# EAGLE design LSR_GPS_Tracker_Base_Station (EAGLE 9.7.0)

## Sheet 1 of 2
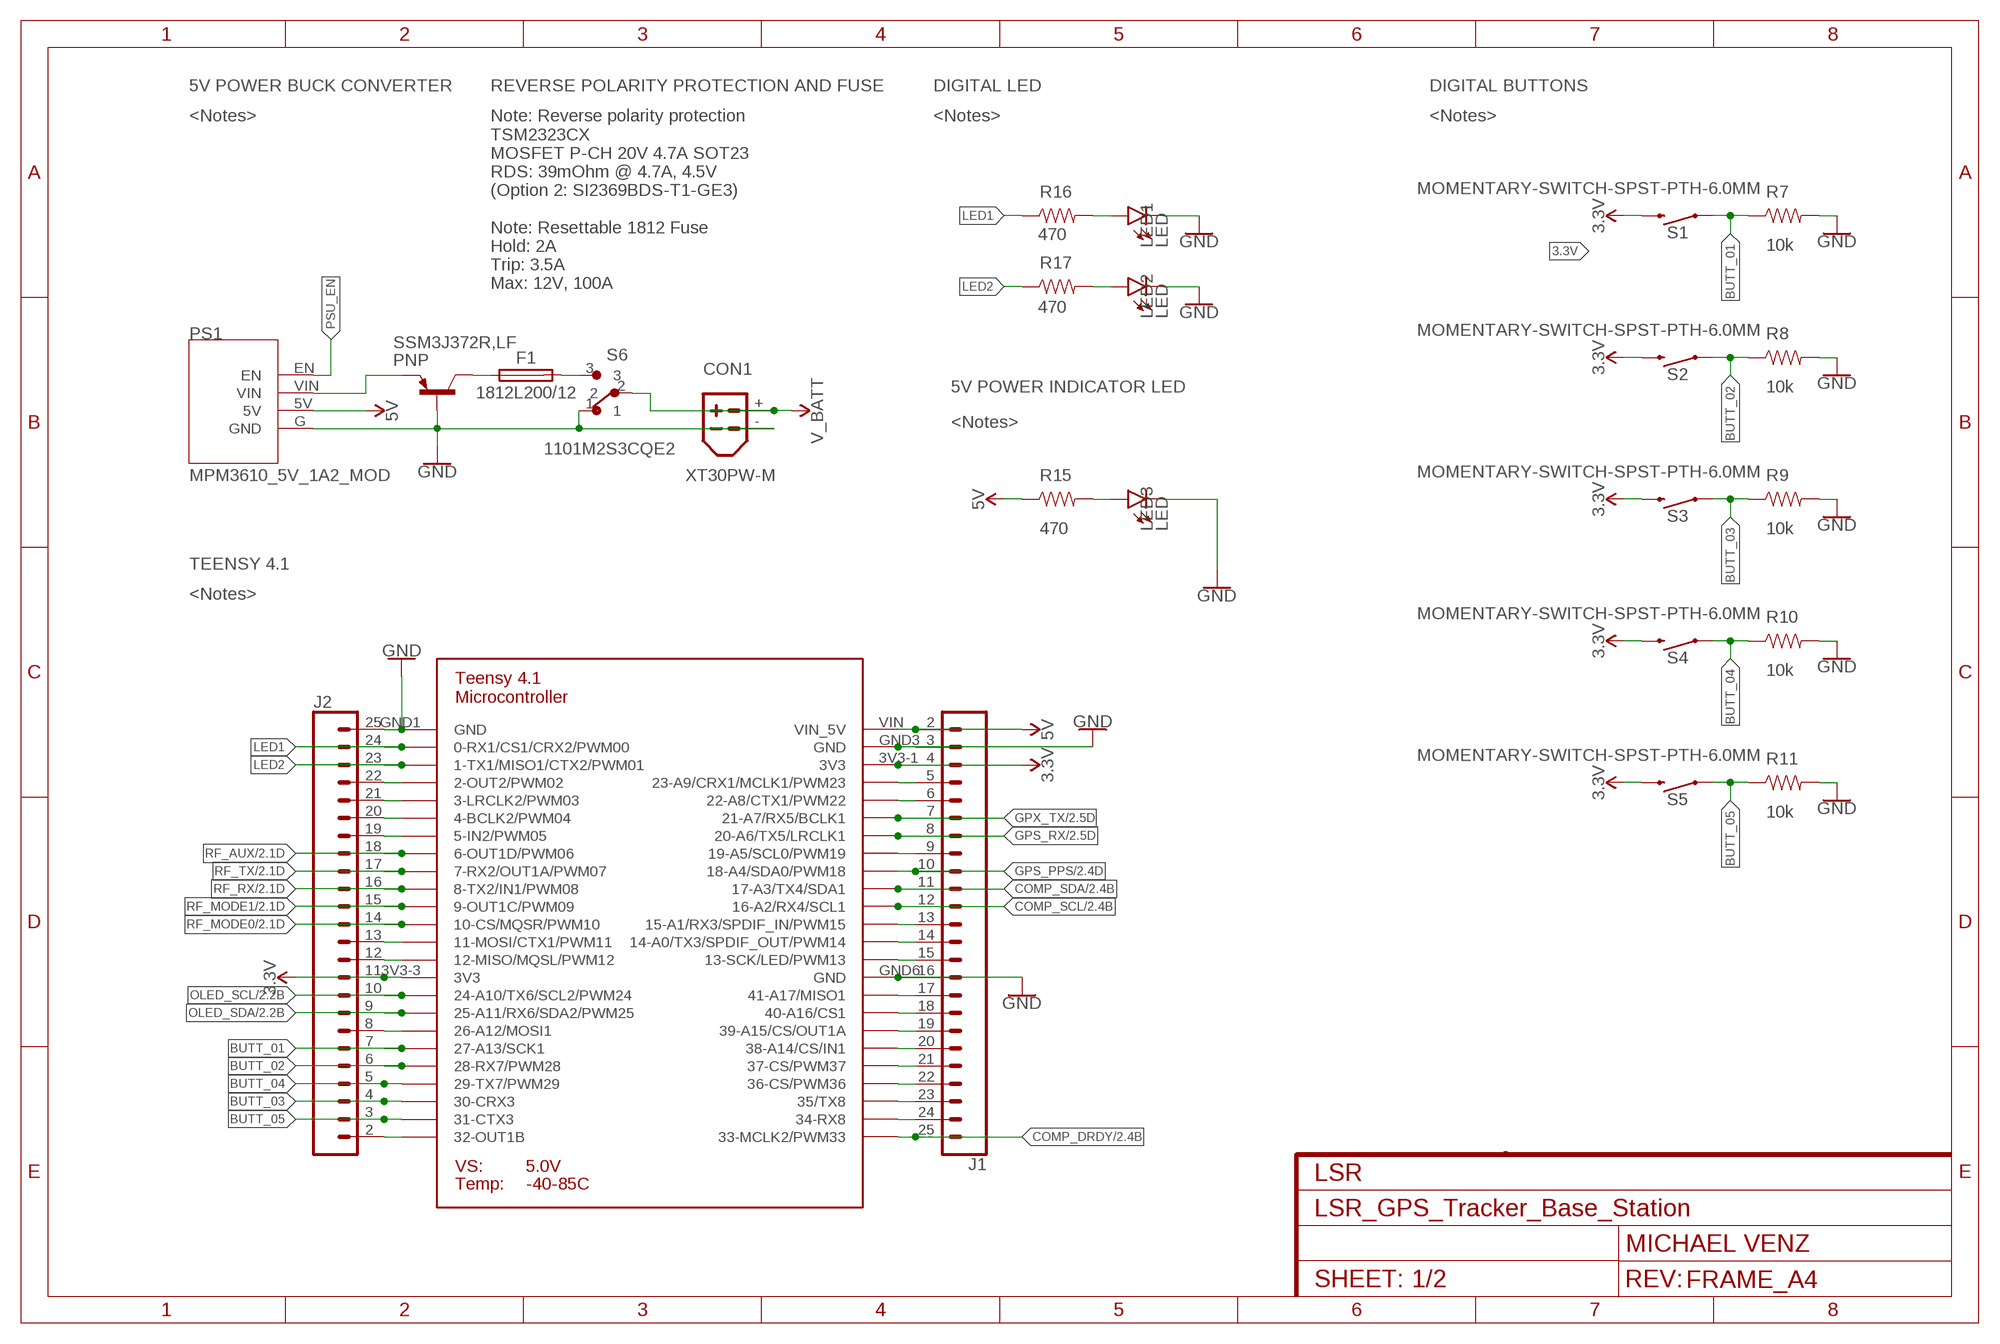
[diagram p0: schematic, sheet 1]

### Parts
CON1  XT30PW-M  [XT30PW-PLUG]
F1  1812L200/12  [FUSC4532X125]
J1  CONN_24  [1X24]
J2  CONN_24  [1X24]
LED1  LED  [0805_LED]
LED2  LED  [0805_LED]
LED3  LED  [0805_LED]
PS1  MPM3610_5V_1A2_MOD  [MPM3610_5V_1A2_FP]
R7  10k  0805_RESISTOR  [0805_RESISTOR_FP]
R8  10k  0805_RESISTOR  [0805_RESISTOR_FP]
R9  10k  0805_RESISTOR  [0805_RESISTOR_FP]
R10  10k  0805_RESISTOR  [0805_RESISTOR_FP]
R11  10k  0805_RESISTOR  [0805_RESISTOR_FP]
R15  470  0805_RESISTOR  [0805_RESISTOR_FP]
R16  470  0805_RESISTOR  [0805_RESISTOR_FP]
R17  470  0805_RESISTOR  [0805_RESISTOR_FP]
S1  MOMENTARY-SWITCH-SPST-PTH-6.0MM  [TACTILE_SWITCH_PTH_6.0MM]
S2  MOMENTARY-SWITCH-SPST-PTH-6.0MM  [TACTILE_SWITCH_PTH_6.0MM]
S3  MOMENTARY-SWITCH-SPST-PTH-6.0MM  [TACTILE_SWITCH_PTH_6.0MM]
S4  MOMENTARY-SWITCH-SPST-PTH-6.0MM  [TACTILE_SWITCH_PTH_6.0MM]
S5  MOMENTARY-SWITCH-SPST-PTH-6.0MM  [TACTILE_SWITCH_PTH_6.0MM]
S6  1101M2S3CQE2  [SW_1101M2S3CQE2]
SSM3J372R,LF  PNP  PNP_SOT23  [SOT95P237X112-3N]
U$3  TEENSY_4_1  [TEENSY_4_1_FP]

### Nets
3.3V: J1.4 J2.11 S1.3 S2.3 S3.3 S4.3 S5.3 U$3.3V3-1(3V3) U$3.3V3-3(3V3) ; also sheet 2
5V: J1.2 PS1.5V R15.1 U$3.VIN(VIN_5V) ; also sheet 2
BUTT_01: J2.7 R7.1 S1.1 U$3.27-A13/SCK1
BUTT_02: J2.6 R8.1 S2.1 U$3.28-RX7/PWM28
BUTT_03: J2.4 R9.1 S3.1 U$3.30-CRX3
BUTT_04: J2.5 R10.1 S4.1 U$3.29-TX7/PWM29
BUTT_05: J2.3 R11.1 S5.1 U$3.31-CTX3
COMP_DRDY: J1.25 U$3.33-MCLK2/PWM33 ; also sheet 2
COMP_SCL: J1.12 U$3.16-A2/RX4/SCL1 ; also sheet 2
COMP_SDA: J1.11 U$3.17-A3/TX4/SDA1 ; also sheet 2
GND: CON1.- J1.3 J1.16 J2.25 LED1.C LED2.C LED3.C PS1.G(GND) R7.2 R8.2 R9.2 R10.2 R11.2 S6.1 SSM3J372R,LF.1(B) U$3.GND1(GND) U$3.GND3(GND) U$3.GND6(GND) ; also sheet 2
GPS_PPS: J1.10 U$3.18-A4/SDA0/PWM18 ; also sheet 2
GPS_RX: J1.8 U$3.20-A6/TX5/LRCLK1 ; also sheet 2
GPX_TX: J1.7 U$3.21-A7/RX5/BCLK1 ; also sheet 2
LED1: J2.24 R16.1 U$3.0-RX1/CS1/CRX2/PWM00
LED2: J2.23 R17.1 U$3.1-TX1/MISO1/CTX2/PWM01
N$1: J1.5 U$3.23-A9/CRX1/MCLK1/PWM23
N$2: J1.6 U$3.22-A8/CTX1/PWM22
N$4: J1.13 U$3.15-A1/RX3/SPDIF_IN/PWM15
N$6: J2.2 U$3.32-OUT1B
N$7: J1.14 U$3.14-A0/TX3/SPDIF_OUT/PWM14
N$8: J1.15 U$3.13-SCK/LED/PWM13
N$9: J1.17 U$3.41-A17/MISO1
N$10: J1.18 U$3.40-A16/CS1
N$11: J1.19 U$3.39-A15/CS/OUT1A
N$12: J1.20 U$3.38-A14/CS/IN1
N$13: J1.21 U$3.37-CS/PWM37
N$14: J1.22 U$3.36-CS/PWM36
N$15: J1.23 U$3.35-TX8(35/TX8)
N$16: J1.24 U$3.34-RX8
N$19: J1.9 U$3.19-A5/SCL0/PWM19
N$20: J2.21 U$3.3-LRCLK2/PWM03
N$21: J2.20 U$3.4-BCLK2/PWM04
N$22: J2.19 U$3.5-IN2/PWM05
N$23: J2.13 U$3.11-MOSI/CTX1/PWM11
N$24: J2.12 U$3.12-MISO/MQSL/PWM12
N$26: J2.8 U$3.26-A12/MOSI1
N$28: J2.22 U$3.2-OUT2/PWM02
N$32: LED3.A R15.2
N$33: LED1.A R16.2
N$42: F1.2 S6.3
N$43: F1.1 SSM3J372R,LF.3(C)
N$44: PS1.VIN SSM3J372R,LF.2(E)
N$53: LED2.A R17.2
OLED_SCL: J2.10 U$3.24-A10/TX6/SCL2/PWM24 ; also sheet 2
OLED_SDA: J2.9 U$3.25-A11/RX6/SDA2/PWM25 ; also sheet 2
PSU_EN: PS1.EN
RF_AUX: J2.18 U$3.6-OUT1D/PWM06 ; also sheet 2
RF_MODE0: J2.14 U$3.10-CS\MQSR/PWM10(10-CS/MQSR/PWM10) ; also sheet 2
RF_MODE1: J2.15 U$3.9-OUT1C/PWM09 ; also sheet 2
RF_RX: J2.16 U$3.8-TX2/IN1/PWM08 ; also sheet 2
RF_TX: J2.17 U$3.7-RX2/OUT1A/PWM07 ; also sheet 2
V_BATT: CON1.+ S6.2

### Notes on the sheet
- 5V POWER BUCK CONVERTER | REVERSE POLARITY PROTECTION AND FUSE | DIGITAL LED | DIGITAL BUTTONS
- <Notes>
- Note: Reverse polarity protection
  TSM2323CX 
  MOSFET P-CH 20V 4.7A SOT23
  RDS: 39mOhm @ 4.7A, 4.5V
  (Option 2: SI2369BDS-T1-GE3)
  
  Note: Resettable 1812 Fuse 
  Hold: 2A
  Trip: 3.5A
  Max: 12V, 100A
- <Notes> | <Notes>
- 5V POWER INDICATOR LED
- <Notes>
- TEENSY 4.1
- <Notes>

## Sheet 2 of 2
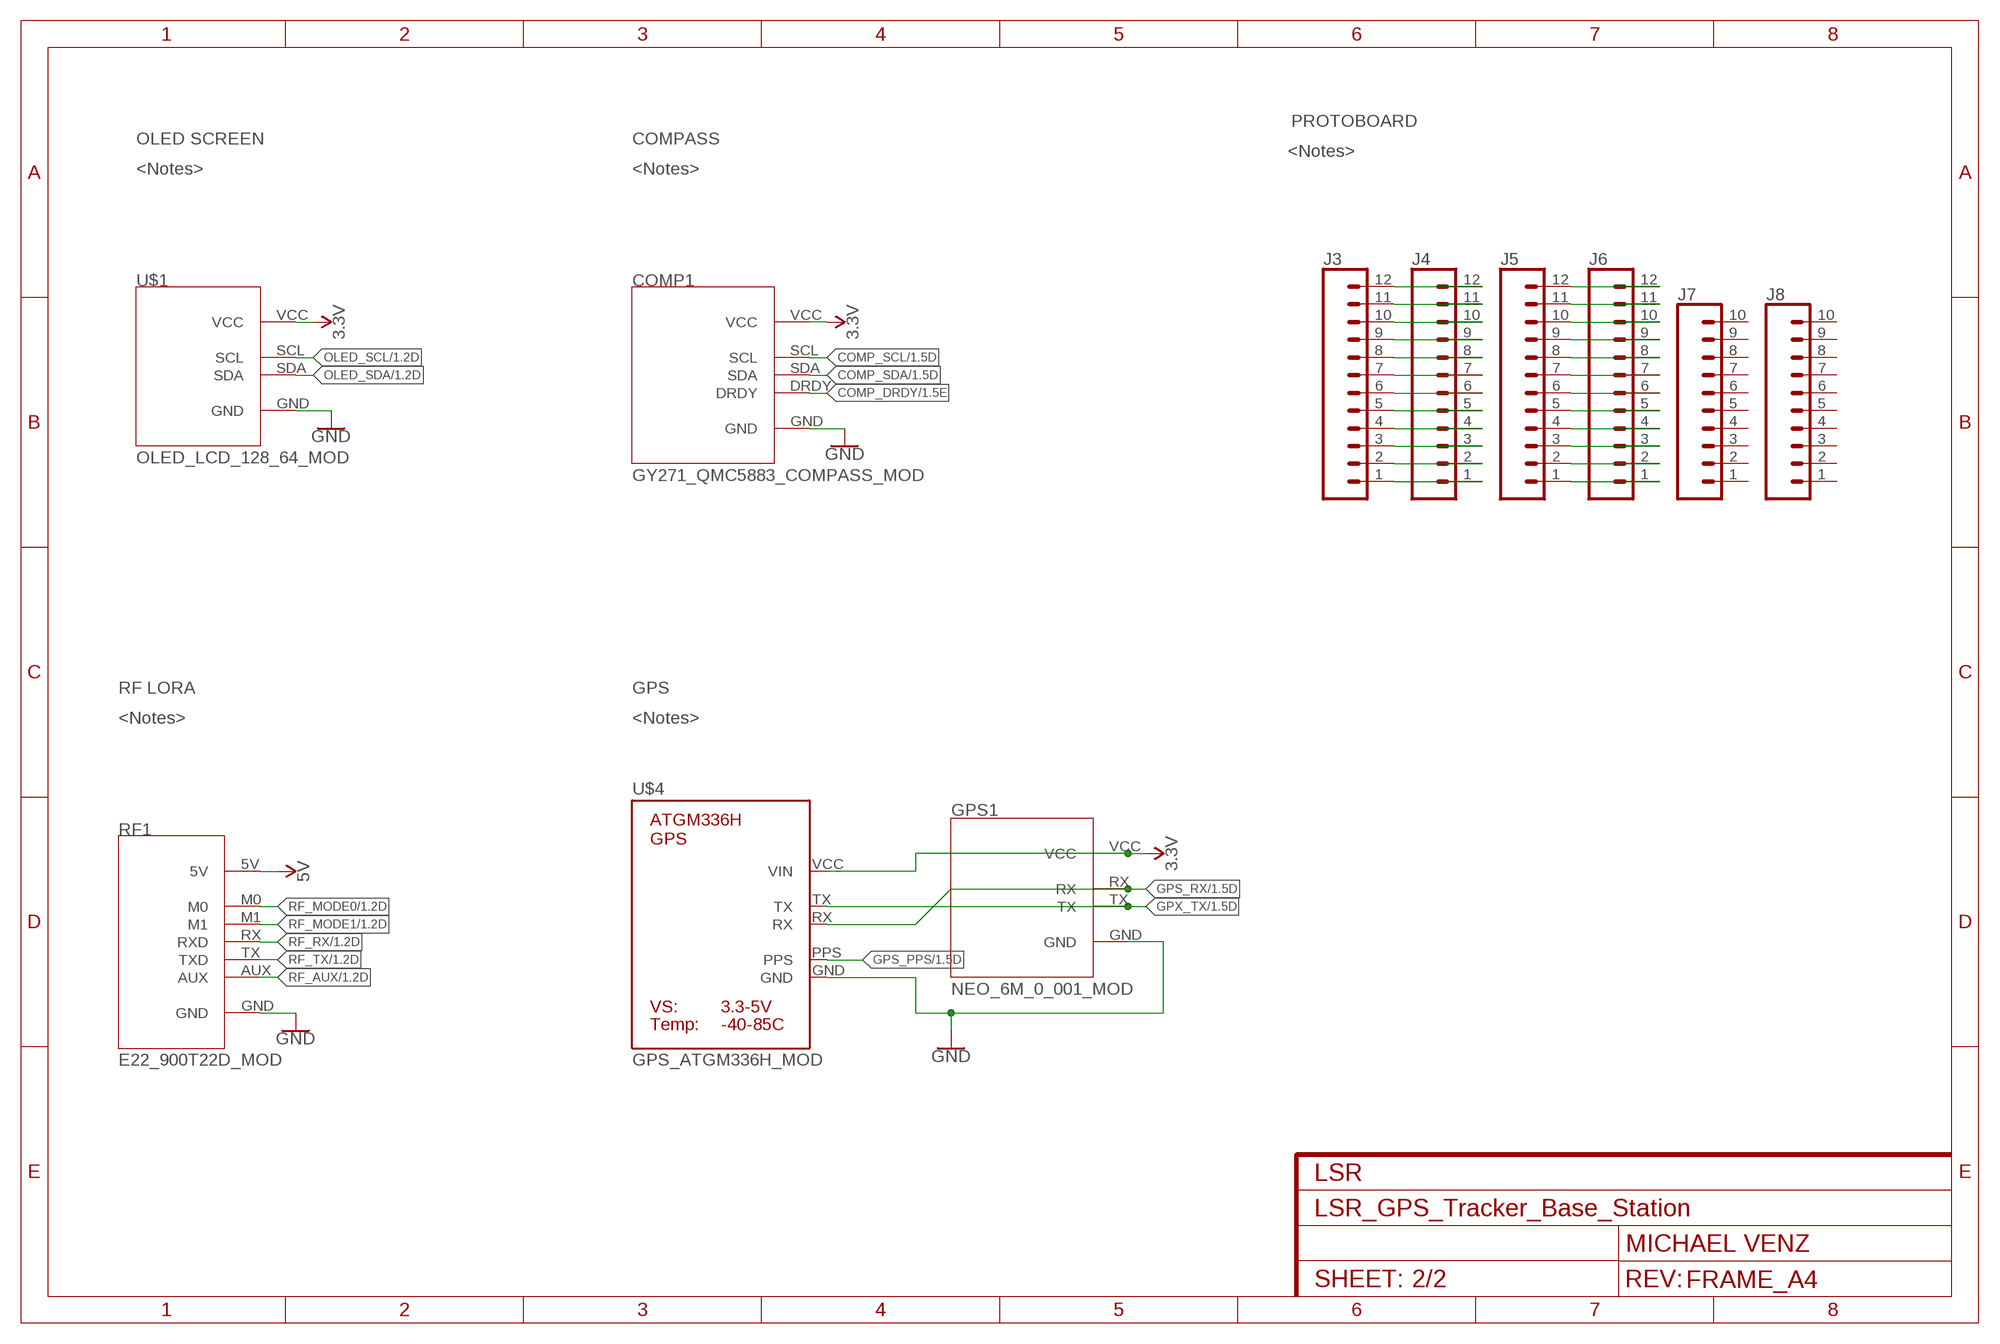
[diagram p1: schematic, sheet 2]

### Parts
COMP1  GY271_QMC5883_COMPASS_MOD  [GY271_QMC5883_COMPASS_MOD_FP]
GPS1  NEO_6M_0_001_MOD  [NEO_6M_0_001_MOD_FP]
J3  CONN_12NO_SILK  [1X12_NO_SILK]
J4  CONN_12NO_SILK  [1X12_NO_SILK]
J5  CONN_12NO_SILK  [1X12_NO_SILK]
J6  CONN_12NO_SILK  [1X12_NO_SILK]
J7  CONN_10NO_SILK_PTH_FEMALE  [1X10_NO_SILK]
J8  CONN_10NO_SILK_PTH_FEMALE  [1X10_NO_SILK]
RF1  E22_900T22D_MOD  [E22_900T22D_MOD_FP]
U$1  OLED_LCD_128_64_MOD  [OLED_LCD_128_64_MOD_FP]
U$4  GPS_ATGM336H_MOD  [GPS_ATGM336H_FP]

### Nets
3.3V: COMP1.VCC GPS1.VCC U$1.VCC U$4.VCC(VIN) ; also sheet 1
5V: RF1.5V ; also sheet 1
COMP_DRDY: COMP1.DRDY ; also sheet 1
COMP_SCL: COMP1.SCL ; also sheet 1
COMP_SDA: COMP1.SDA ; also sheet 1
GND: COMP1.GND GPS1.GND RF1.GND U$1.GND U$4.GND ; also sheet 1
GPS_PPS: U$4.PPS ; also sheet 1
GPS_RX: GPS1.RX U$4.RX ; also sheet 1
GPX_TX: GPS1.TX U$4.TX ; also sheet 1
N$5: J3.12 J4.12
N$17: J3.11 J4.11
N$18: J3.10 J4.10
N$25: J3.9 J4.9
N$27: J3.8 J4.8
N$29: J3.7 J4.7
N$30: J3.6 J4.6
N$31: J3.5 J4.5
N$34: J3.4 J4.4
N$35: J3.3 J4.3
N$36: J3.2 J4.2
N$37: J3.1 J4.1
N$38: J5.12 J6.12
N$39: J5.11 J6.11
N$40: J5.10 J6.10
N$41: J5.9 J6.9
N$45: J5.8 J6.8
N$46: J5.7 J6.7
N$47: J5.6 J6.6
N$48: J5.5 J6.5
N$49: J5.4 J6.4
N$50: J5.3 J6.3
N$51: J5.2 J6.2
N$52: J5.1 J6.1
OLED_SCL: U$1.SCL ; also sheet 1
OLED_SDA: U$1.SDA ; also sheet 1
RF_AUX: RF1.AUX ; also sheet 1
RF_MODE0: RF1.M0 ; also sheet 1
RF_MODE1: RF1.M1 ; also sheet 1
RF_RX: RF1.RX(RXD) ; also sheet 1
RF_TX: RF1.TX(TXD) ; also sheet 1
Unconnected: J7.1 J7.2 J7.3 J7.4 J7.5 J7.6 J7.7 J7.8 J7.9 J7.10 J8.1 J8.2 J8.3 J8.4 J8.5 J8.6 J8.7 J8.8 J8.9 J8.10

### Notes on the sheet
- PROTOBOARD
- OLED SCREEN | COMPASS | <Notes>
- <Notes> | <Notes>
- RF LORA | GPS
- <Notes> | <Notes>

## Library data of the parts
COMP1 = LSR_Modules:GY271_QMC5883_COMPASS_MOD
CON1 = LSR_Connectors:XT30: AMASS XT30 connector Store in Japan AMASS XT30 connector <https://szc.jp/ams-xt30>
F1 = Fuse:1812L: 1812L Series PTC provides surface mount overcurrent protection for applications where resettable protection is desired. Datasheet <https://www.littelfuse.com/~/media/electronics/datasheets/resettable_ptcs/littelfuse_ptc_1812l_datasheet.pdf.pdf>; CATEGORY: FUSE; DESCRIPTION: Resettable PTCs; MANUFACTURER: Littlefuse; MPN: 1812L200/12; OPERATING_TEMPERATURE: -40°C to +85°C; PART_STATUS: ACTIVE; ROHS_COMPLIANCE: RoHS Compliant; SERIES: 1812L; SUBCATEGORY: Resettable; TYPE: PTC
GPS1 = LSR_Modules:NEO_6M_0_001_MOD
J1 J2 = SparkFun-Connectors:CONN_24: Multi connection point. Often used as Generic Header-pin footprint for 0.1 inch spaced/style header connections On any of the 0.1 inch spaced packages, you can populate with these: Break Away Headers - Straight <https://www.sparkfun.com/products/116> (PRT-00116) Break Away Male Headers - Right Angle <https://www.sparkfun.com/products/553> (PRT-00553) Female Headers <https://www.sparkfun.com/products/115> (PRT-00115) Break Away Headers - Machine Pin <https://www.sparkfun.com/products/117> (PRT-00117) Break Away Female Headers - Swiss Machine Pin <https://www.sparkfun.com/products/743> (PRT-00743) For SCREWTERMINALS and SPRING TERMINALS visit here: Screw Terimnals on SparkFun.com <https://www.sparkfun.com/search/results?term=Screw+Terminals> (5mm/3.5mm/2.54mm spacing) This device is also useful as a general connection point to wire up your design to another part of your project. Our various solder wires solder well into these plated through hole pads. Hook-Up Wire - Assortment (Stranded, 22 AWG) <https://www.sparkfun.com/products/11375> (PRT-11375) Hook-Up Wire - Assortment (Solid Core, 22 AWG) <https://www.sparkfun.com/products/11367> (PRT-11367) View the entire wire category on our website here <https://www.sparkfun.com/categories/141> Special notes: Molex polarized connector foot print use with SKU : PRT-08231 with associated crimp pins and housings. 1MM SMD Version SKU: PRT-10208 NOTES ON THE VARIANTS LOCK and LOCK_LONGPADS... This footprint was designed to help hold the alignment of a through-hole component (i.e. 6-pin header) while soldering it into place. You may notice that each hole has been shifted either up or down by 0.005 of an inch from it's more standard position (which is a perfectly straight line). This slight alteration caused the pins (the squares in the middle) to touch the edges of the holes. Because they are alternating, it causes a "brace" to hold the component in place. 0.005 has proven to be the perfect amount of "off-center" position when using our standard breakaway headers. Although looks a little odd when you look at the bare footprint, once you have a header in there, the alteration is very hard to notice. Also,if you push a header all the way into place, it is covered up entirely on the bottom side.
J3-J6 = SparkFun-Connectors:CONN_12: Multi connection point. Often used as Generic Header-pin footprint for 0.1 inch spaced/style header connections On any of the 0.1 inch spaced packages, you can populate with these: Break Away Headers - Straight <https://www.sparkfun.com/products/116> (PRT-00116) Break Away Male Headers - Right Angle <https://www.sparkfun.com/products/553> (PRT-00553) Female Headers <https://www.sparkfun.com/products/115> (PRT-00115) Break Away Headers - Machine Pin <https://www.sparkfun.com/products/117> (PRT-00117) Break Away Female Headers - Swiss Machine Pin <https://www.sparkfun.com/products/743> (PRT-00743) For SCREWTERMINALS and SPRING TERMINALS visit here: Screw Terimnals on SparkFun.com <https://www.sparkfun.com/search/results?term=Screw+Terminals> (5mm/3.5mm/2.54mm spacing) This device is also useful as a general connection point to wire up your design to another part of your project. Our various solder wires solder well into these plated through hole pads. Hook-Up Wire - Assortment (Stranded, 22 AWG) <https://www.sparkfun.com/products/11375> (PRT-11375) Hook-Up Wire - Assortment (Solid Core, 22 AWG) <https://www.sparkfun.com/products/11367> (PRT-11367) View the entire wire category on our website here <https://www.sparkfun.com/categories/141> Special notes: Molex polarized connector foot print use with SKU : PRT-08231 with associated crimp pins and housings. 1MM SMD Version SKU: PRT-10208 NOTES ON THE VARIANTS LOCK and LOCK_LONGPADS... This footprint was designed to help hold the alignment of a through-hole component (i.e. 6-pin header) while soldering it into place. You may notice that each hole has been shifted either up or down by 0.005 of an inch from it's more standard position (which is a perfectly straight line). This slight alteration caused the pins (the squares in the middle) to touch the edges of the holes. Because they are alternating, it causes a "brace" to hold the component in place. 0.005 has proven to be the perfect amount of "off-center" position when using our standard breakaway headers. Although looks a little odd when you look at the bare footprint, once you have a header in there, the alteration is very hard to notice. Also,if you push a header all the way into place, it is covered up entirely on the bottom side.
J7 J8 = SparkFun-Connectors:CONN_10: Multi connection point. Often used as Generic Header-pin footprint for 0.1 inch spaced/style header connections On any of the 0.1 inch spaced packages, you can populate with these: Break Away Headers - Straight <https://www.sparkfun.com/products/116> (PRT-00116) Break Away Male Headers - Right Angle <https://www.sparkfun.com/products/553> (PRT-00553) Female Headers <https://www.sparkfun.com/products/115> (PRT-00115) Break Away Headers - Machine Pin <https://www.sparkfun.com/products/117> (PRT-00117) Break Away Female Headers - Swiss Machine Pin <https://www.sparkfun.com/products/743> (PRT-00743) Arduino Stackable Header - 10 Pin <https://www.sparkfun.com/products/11376> (PRT-11376) For SCREWTERMINALS and SPRING TERMINALS visit here: Screw Terimnals on SparkFun.com <https://www.sparkfun.com/search/results?term=Screw+Terminals> (5mm/3.5mm/2.54mm spacing) This device is also useful as a general connection point to wire up your design to another part of your project. Our various solder wires solder well into these plated through hole pads. Hook-Up Wire - Assortment (Stranded, 22 AWG) <https://www.sparkfun.com/products/11375> (PRT-11375) Hook-Up Wire - Assortment (Solid Core, 22 AWG) <https://www.sparkfun.com/products/11367> (PRT-11367) View the entire wire category on our website here <https://www.sparkfun.com/categories/141> Special notes: Molex polarized connector foot print use with SKU : PRT-08231 with associated crimp pins and housings. 1MM SMD Version SKU: PRT-10208 NOTES ON THE VARIANTS LOCK and LOCK_LONGPADS... This footprint was designed to help hold the alignment of a through-hole component (i.e. 6-pin header) while soldering it into place. You may notice that each hole has been shifted either up or down by 0.005 of an inch from it's more standard position (which is a perfectly straight line). This slight alteration caused the pins (the squares in the middle) to touch the edges of the holes. Because they are alternating, it causes a "brace" to hold the component in place. 0.005 has proven to be the perfect amount of "off-center" position when using our standard breakaway headers. Although looks a little odd when you look at the bare footprint, once you have a header in there, the alteration is very hard to notice. Also,if you push a header all the way into place, it is covered up entirely on the bottom side.; PROD_ID: CONN-11563
LED1-LED3 = LSR_Generic_Parts:LED
PS1 = LSR_PSU:MPM3610_5V_1A2_MOD
R7-R11 = LSR_Generic_Parts:0805_RESISTOR
R15-R17 = LSR_Generic_Parts:0805_RESISTOR; VALUE: 10k
RF1 = LSR_RF_WIFI:E22_900T22D_MOD
S1-S5 = LSR_Switches:MOMENTARY-SWITCH-SPST: Momentary Switch (Pushbutton) - SPST Normally-open (NO) SPST momentary switches (buttons, pushbuttons). Variants PTH-12MM - 12mm square, through-hole Momentary Pushbutton Switch - 12mm Square <https://www.sparkfun.com/products/9190> (COM-09190) PTH-6.0MM, PTH-6.0MM-KIT - 6.0mm square, through-hole Mini Pushbutton Switch <https://www.sparkfun.com/products/97> (COM-00097) KIT package intended for soldering kit's - only one side of pads' copper is exposed. PTH-RIGHT-ANGLE-KIT - Right-angle, through-hole Right Angle Tactile Button <https://www.sparkfun.com/products/10791> - Used on SparkFun BigTime Watch Kit <https://www.sparkfun.com/products/11734> SMD-12MM - 12mm square, surface-mount Tactile Button - SMD (12mm) <https://www.sparkfun.com/products/12993> (COM-12993) Used on SparkFun PicoBoard <https://www.sparkfun.com/products/11888> SMD-4.5MM - 4.5mm Square Trackball Switch Used on SparkFun Blackberry Trackballer Breakout <https://www.sparkfun.com/products/13169> SMD-4.6MMX2.8MM - 4.60mm x 2.80mm, surface mount Used on SparkFun SAMD21 Mini Breakout <https://www.sparkfun.com/products/13664> SMD-5.2MM, SMD-5.2-REDUNDANT - 5.2mm square, surface-mount Mini Pushbutton Switch - SMD <https://www.sparkfun.com/products/8720> (COM-08720) Used on Arduino Pro Mini <https://www.sparkfun.com/products/11114> REDUNDANT package connects both switch circuits together SMD-6.0X3.5MM - 6.0 x 3.5mm, surface mount Momentary Reset Switch SMD <https://www.sparkfun.com/products/8229> (COM-08229) SMD-6.2MM-TALL - 6.2mm square, surface mount Tactile Button - SMD (6mm) <https://www.sparkfun.com/products/12992> Used on SparkFun Digital Sandbox <https://www.sparkfun.com/products/12651> SMD-RIGHT-ANGLE - Right-angle, surface mount Used on SparkFun Block for Intel® Edison - Arduino <https://www.sparkfun.com/products/13036>; PROD_ID: SWCH-08441; SF_SKU: COM-00097
S6 = LSR_Switches:1101M2S3CQE2: Switch, Slide, PC Terminal, SPST, ON-NONE-OFF, 0.4VA MAX@120VAC OR VDC MAX; DESCRIPTION: Switch, Slide, PC Terminal, SPST, ON-NONE-OFF, 0.4VA MAX@120VAC OR VDC MAX; DIGI-KEY_PART_NUMBER: CKN5001-ND; DIGI-KEY_PURCHASE_URL: https://www.digikey.com.au/product-detail/en/c-k/1101M2S3CQE2/CKN5001-ND/67042?utm_source=snapeda&utm_medium=aggregator&utm_campaign=symbol; MF: C&K; MP: 1101M2S3CQE2; PACKAGE: None
SSM3J372R,LF = Transistor:PNP: PNP - Generic; CATEGORY: Transistor; SUB-CATEGORY: BJT; TYPE: PNP
U$1 = LSR_Modules:OLED_LCD_128_64_MOD
U$3 = LSR_Microcontrollers:TEENSY_4_1
U$4 = LSR_Modules:GPS_ATGM336H_MOD

## Board
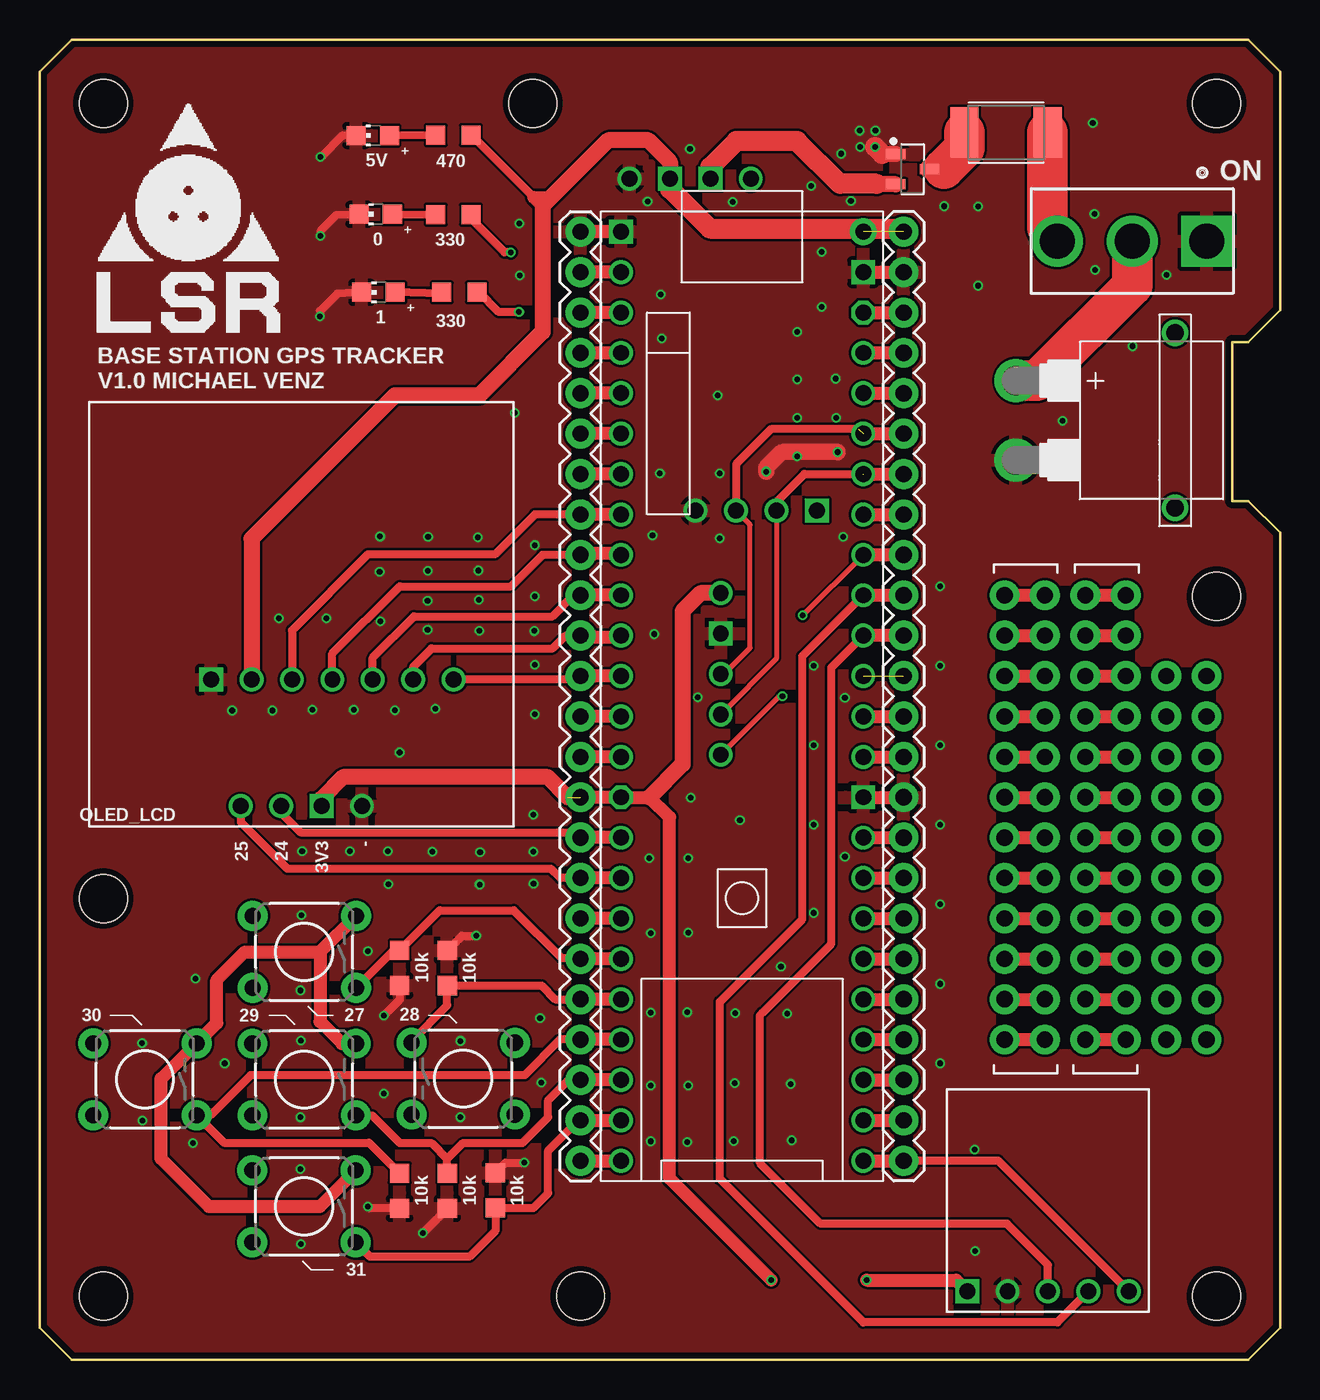
[diagram p2: board, top side]
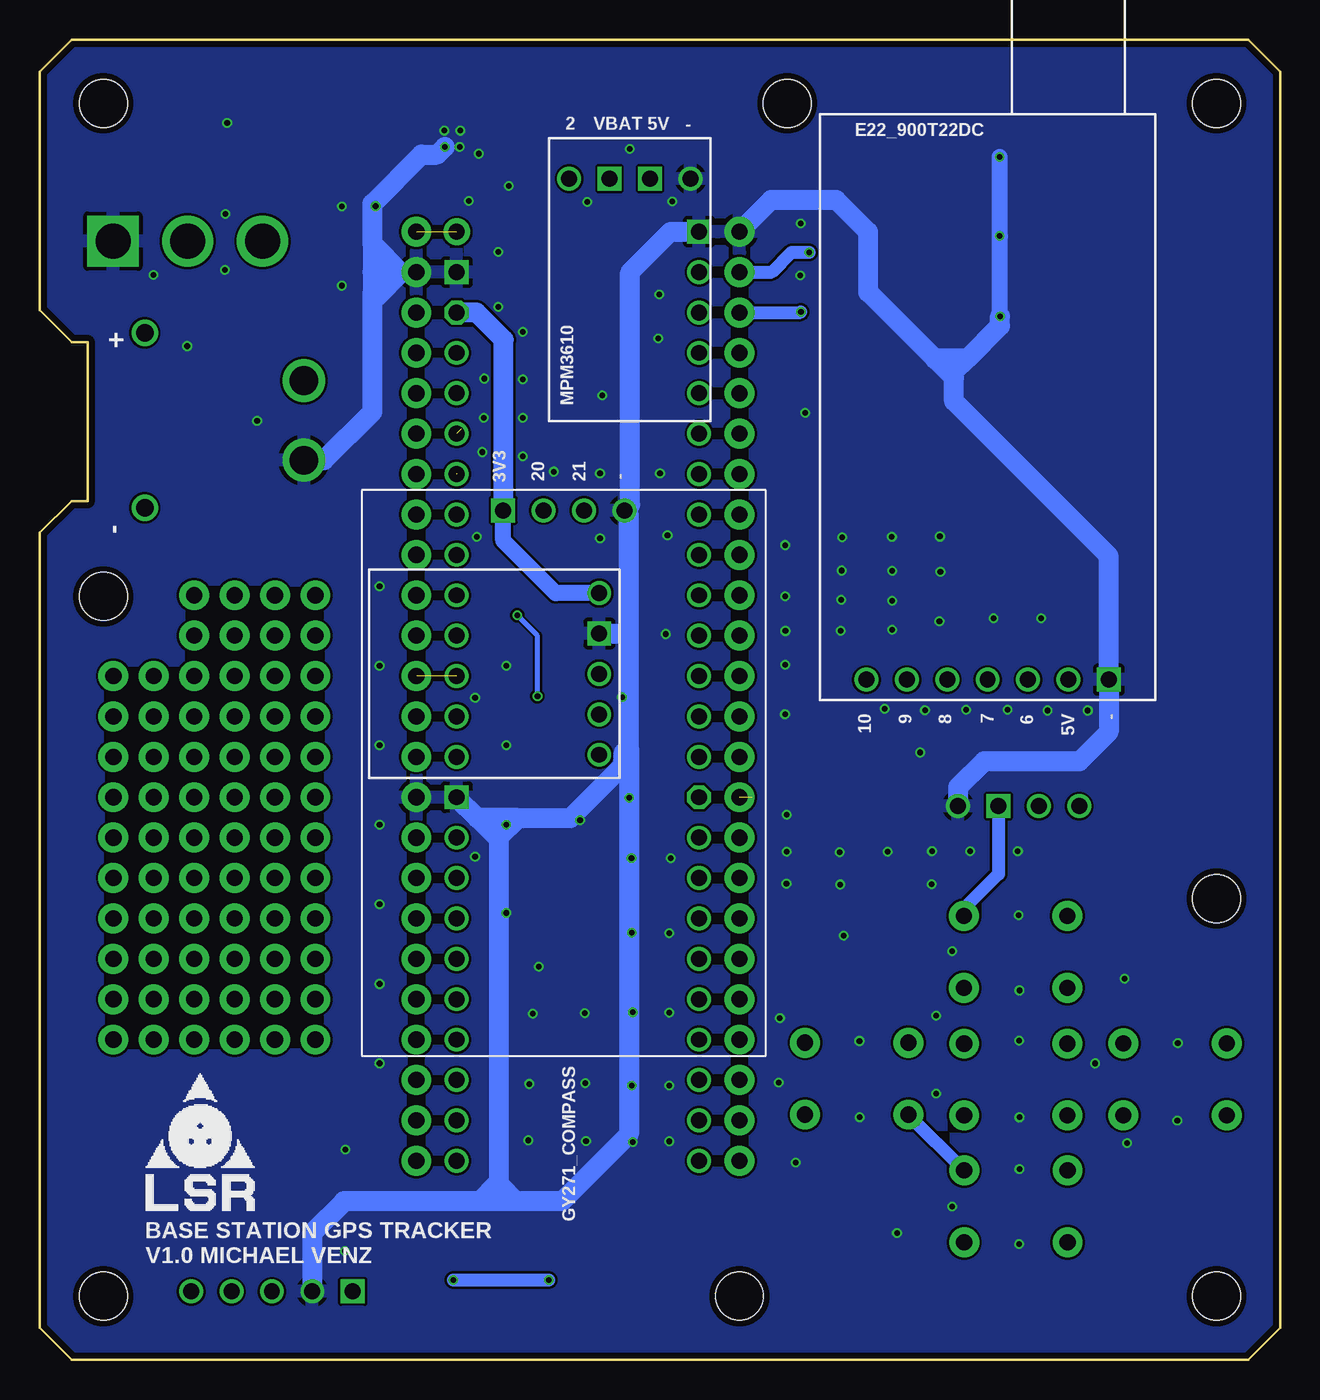
[diagram p3: board, bottom side, seen from below]

Size 78 x 83 mm. Coordinates in mm from the lower left corner, seen from the top.
Outline: 0,2 2,0 76,0 78,2 78,52 76,54 75,54 75,64 76,64 78,66 78,81 76,83 2,83 0,81 0,2
Copper layers (1*16): Top 0.035559375mm / dielectric 1.6mm / Bottom 0.035559375mm
Design rules "oshpark-2layer": minimum track width 6mil, minimum drill 10mil, track to track 6mil, track to pad 6mil, pad to pad 6mil, via to via 6mil, smd to smd 6mil, copper to edge 15mil, drill to drill 6mil, minimum pad ring 5mil, minimum via ring 5mil, stop-mask expansion 2.5mil, vias tented up to drill 0mil, thermal gap 10mil
Holes 3 mm at 4,4 4,79 34,4 74,79 74,4 4,29 31,79 74,48

### Footprints (pad centres in the part's own frame; a part is rotated, then mirrored left to right if it is on the bottom)
GY271_QMC5883_COMPASS_MOD_FP = drill 1: DRDY -6.35,-5.08; GND -6.35,2.54; SCL -6.35,0; SDA -6.35,-2.54 | drill 1 square: VCC -6.35,5.08
XT30PW-PLUG = drill 1.8: + -2.5,0; - 2.5,0 | drill 1.1: P$3 -5.5,10; P$4 5.5,10
FUSC4532X125 = smd 1.78 x 3.15: 1 -2.615,0; 2 2.615,0
NEO_6M_0_001_MOD_FP = drill 1: GND -15.24,3.81; RX -15.24,-1.27; TX -15.24,1.27 | drill 1 square: VCC -15.24,-3.81
1X24 = drill 1.016 pad 1.88: 2 -26.67,0; 3 -24.13,0; 4 -21.59,0; 5 -19.05,0; 6 -16.51,0; 7 -13.97,0; 8 -11.43,0; 9 -8.89,0; 10 -6.35,0; 11 -3.81,0; 12 -1.27,0; 13 1.27,0; 14 3.81,0; 15 6.35,0; 16 8.89,0; 17 11.43,0; 18 13.97,0; 19 16.51,0; 20 19.05,0; 21 21.59,0; 22 24.13,0; 23 26.67,0; 24 29.21,0; 25 31.75,0
1X12_NO_SILK = drill 1.016 pad 1.88: 1 0,0; 2 2.54,0; 3 5.08,0; 4 7.62,0; 5 10.16,0; 6 12.7,0; 7 15.24,0; 8 17.78,0; 9 20.32,0; 10 22.86,0; 11 25.4,0; 12 27.94,0
1X10_NO_SILK = drill 1.016 pad 1.88: 1 0,0; 2 2.54,0; 3 5.08,0; 4 7.62,0; 5 10.16,0; 6 12.7,0; 7 15.24,0; 8 17.78,0; 9 20.32,0; 10 22.86,0
0805_LED = smd 1.2 x 1.2: A -1.05,0; C 1.05,0
MPM3610_5V_1A2_FP = drill 1 square: 5V -6.35,1.27; VIN -6.35,-1.27 | drill 1: EN -6.35,-3.81; G -6.35,3.81
0805_RESISTOR_FP = smd 1.2 x 1.2: 1 -1.109,0; 2 1.101,0
E22_900T22D_MOD_FP = drill 1: 5V -17.78,-6.35; AUX -17.78,-3.81; M0 -17.78,6.35; M1 -17.78,3.81; RX -17.78,1.27; TX -17.78,-1.27 | drill 1 square: GND -17.78,-8.89
TACTILE_SWITCH_PTH_6.0MM = drill 1.016 pad 1.88: 1 -3.251,2.261; 2 3.251,2.261; 3 -3.251,-2.261; 4 3.251,-2.261
SW_1101M2S3CQE2 = drill 2.2 pad 3 square: 1 0,4.7 | drill 2.2 pad 3: 2 0,0; 3 0,-4.7
SOT95P237X112-3N = smd 1.224 x 0.625: 1 -1.064,0.95; 2 -1.064,-0.95; 3 1.064,0
OLED_LCD_128_64_MOD_FP = drill 1: GND -12.7,-3.81; SCL -12.7,1.27; SDA -12.7,3.81 | drill 1 square: VCC -12.7,-1.27
TEENSY_4_1_FP = drill 1: 0-RX1/CS1/CRX2/PWM00 -7.62,25.4; 1-TX1/MISO1/CTX2/PWM01 -7.62,22.86; 2-OUT2/PWM02 -7.62,20.32; 3-LRCLK2/PWM03 -7.62,17.78; 4-BCLK2/PWM04 -7.62,15.24; 5-IN2/PWM05 -7.62,12.7; 6-OUT1D/PWM06 -7.62,10.16; 7-RX2/OUT1A/PWM07 -7.62,7.62; 8-TX2/IN1/PWM08 -7.62,5.08; 9-OUT1C/PWM09 -7.62,2.54; 10-CS\MQSR/PWM10 -7.62,0; 11-MOSI/CTX1/PWM11 -7.62,-2.54; 12-MISO/MQSL/PWM12 -7.62,-5.08; 13-SCK/LED/PWM13 7.62,-5.08; 14-A0/TX3/SPDIF_OUT/PWM14 7.62,-2.54; 15-A1/RX3/SPDIF_IN/PWM15 7.62,0; 16-A2/RX4/SCL1 7.62,2.54; 17-A3/TX4/SDA1 7.62,5.08; 18-A4/SDA0/PWM18 7.62,7.62; 19-A5/SCL0/PWM19 7.62,10.16; 20-A6/TX5/LRCLK1 7.62,12.7; 21-A7/RX5/BCLK1 7.62,15.24; 22-A8/CTX1/PWM22 7.62,17.78; 23-A9/CRX1/MCLK1/PWM23 7.62,20.32; 24-A10/TX6/SCL2/PWM24 -7.62,-10.16; 25-A11/RX6/SDA2/PWM25 -7.62,-12.7; 26-A12/MOSI1 -7.62,-15.24; 27-A13/SCK1 -7.62,-17.78; 28-RX7/PWM28 -7.62,-20.32; 29-TX7/PWM29 -7.62,-22.86; 30-CRX3 -7.62,-25.4; 31-CTX3 -7.62,-27.94; 32-OUT1B -7.62,-30.48; 33-MCLK2/PWM33 7.62,-30.48; 34-RX8 7.62,-27.94; 35-TX8 7.62,-25.4; 36-CS/PWM36 7.62,-22.86; 37-CS/PWM37 7.62,-20.32; 38-A14/CS/IN1 7.62,-17.78; 39-A15/CS/OUT1A 7.62,-15.24; 40-A16/CS1 7.62,-12.7; 41-A17/MISO1 7.62,-10.16 | drill 1 octagon: 3V3-1 -7.62,-7.62; 3V3-3 7.62,22.86 | drill 1 square: GND1 -7.62,27.94; GND3 7.62,-7.62; GND6 7.62,25.4 | drill 1 pad 1.676: VIN 7.62,27.94
GPS_ATGM336H_FP = drill 1 square: GND -7.62,-2.54 | drill 1: PPS -7.62,5.08; RX -7.62,2.54; TX -7.62,0; VCC -7.62,-5.08

### Placement (x,y rotation side)
COMP1  63.4,10.64 90 top
CON1  61.39,59.07 270 top
F1  60.76,77.17 0 top
GPS1  45.05,38.16 270 bottom
J1  54.32,44.26 270 top
J2  34,39.18 90 top
J3  60.67,20.13 90 top
J4  63.21,20.13 90 top
J5  65.75,20.13 90 top
J6  68.29,20.13 90 top
J7  70.83,20.13 90 top
J8  73.37,20.13 90 top
LED1  21.12,72.03 180 top
LED2  21.3,67.12 180 top
LED3  20.95,76.98 180 top
PS1  40.9,67.92 270 bottom
R7  22.64,24.63 270 top
R8  25.63,24.63 90 top
R9  25.63,10.62 270 top
R10  22.63,10.62 270 top
R11  28.65,10.65 90 top
R15  26,77 180 top
R16  26,72 180 top
R17  26.38,67.12 180 top
RF1  19.67,60.54 90 bottom
S1  16.63,25.64 180 top
S2  26.62,17.68 0 top
S3  16.63,17.62 180 top
S4  6.61,17.64 180 top
S5  16.62,9.64 180 top
S6  68.7,70.34 270 top
SSM3J372R,LF  54.89,74.86 0 top
U$1  16.45,47.51 90 top
U$2  [LSR_LOGO_TEXT_200PX_FP]  3.63,64.63 0 top
U$3  44.16,42.99 0 top
U$4  50.44,43.12 180 bottom
U$5  [LSR_LOGO_TEXT_120PX_FP]  71.3,9.4 0 bottom

### Tracks (layer width: path | path; a pad name or v marks a point on that pad's centre or on a via)
3.3V  (via drill 0.35)  (1 unrouted)
  Top 0.813: J2.11 U$3.3V3-1 38.33,35.37 38.35,35.37 39.6,34.12 39.6,11.4 v46,5 | S5.3 19.87,11.88 17.63,9.63 10.63,9.63 7.63,12.63 7.63,17.66 S4.3 11.13,21.17 11.13,23.87 12.9,25.63 17.63,25.63 | 17.63,25.63 19.88,27.89 S1.3 | 17.63,25.63 17.63,21.26 19.01,19.88 S3.3 | v52,5 57.61,5 COMP1.VCC | U$3.3V3-3 J1.4
  Top 1.016: 33.2,35.37 31.94,36.63 19.08,36.63 17.72,35.27 U$1.VCC | 38.33,35.37 40.42,37.46 40.42,47.08 41.55,48.2 U$4.VCC
  Bottom 0.813: S2.3 S5.3 | U$1.VCC 17.72,30.54 19.88,28.38 S1.3 | v46,5 v52,5
  Bottom 1.016: U$4.VCC 45.56,48.2 48.86,51.5 GPS1.VCC
  Bottom 1.27: GPS1.VCC 48.83,53.44 48.83,64.14 50.53,65.85 U$3.3V3-3
5V  (1 unrouted)
  Top 0.508: 31.08,73.08 27.16,77 R15.1
  Top 0.813: 31.63,72.53 31.08,73.08 32.13,73.08 32.53,73.47
  Top 1.016: PS1.5V 39.63,75.33 38.27,76.68 35.74,76.68 32.53,73.47 31.63,72.58 31.63,72.53 31.63,64.63 27.63,60.63 22.32,60.63 13.32,51.63 RF1.5V
  Top 1.27: PS1.5V 39.63,73.63 42.14,71.12 54.13,71.12 J1.2
BUTT_01
  Top 0.508: S1.1 22.24,25.74 R7.1 25.16,28.26 29.81,28.26 32.82,25.26 33.95,25.26 J2.7
  Top 0.813: U$3.27-A13/SCK1 J2.7
BUTT_02
  Top 0.508: J2.6 32.41,22.67 31.56,23.52 R8.1 25.63,22.29 23.37,20.03 S2.1
  Top 0.813: U$3.28-RX7/PWM28 J2.6
BUTT_03
  Top 0.508: S3.1 20.91,15.36 22.63,13.63 24.63,13.63 25.63,12.63 | R9.1 25.63,12.63 | 25.63,12.63 26.63,13.63 30.36,13.63 31.97,15.24 31.97,16.32 33.24,17.59 J2.4
  Top 0.813: U$3.30-CRX3 J2.4
BUTT_04
  Top 0.508: R10.1 20.71,13.65 11.59,13.65 S4.1 10.74,15.38 13.25,17.89 30.49,17.89 32.73,20.13 J2.5
  Top 0.813: U$3.29-TX7/PWM29 J2.5
BUTT_05
  Top 0.508: S5.1 20.77,6.48 27.02,6.48 28.65,8.11 R11.1 31.04,9.54 31.97,10.48 31.97,13.14 33.87,15.05 J2.3
  Top 0.813: J2.3 U$3.31-CTX3
COMP_DRDY
  Top 0.508: COMP1.DRDY 60.27,12.51 J1.25
  Top 0.813: U$3.33-MCLK2/PWM33 J1.25
COMP_SCL
  Top 0.305: 45.29,21.67 45.44,21.82
  Top 0.508: 45.29,21.67 45.29,12.35 49.09,8.55 60.82,8.55 63.4,5.97 COMP1.SCL | 45.44,21.82 49.77,26.15 49.77,43.52 U$3.16-A2/RX4/SCL1
  Top 0.813: J1.12 U$3.16-A2/RX4/SCL1
COMP_SDA
  Top 0.508: COMP1.SDA 64,2.35 51.78,2.35 42.76,11.37 42.76,22.5 47.95,27.69 47.95,44.23 U$3.17-A3/TX4/SDA1
  Top 0.813: U$3.17-A3/TX4/SDA1 J1.11
GND  (via drill 0.35)
  Top 0.508: R11.2 29.28,12.39 v30.46,12.39 | R8.2 26.55,26.65 v27.44,26.65 | R10.2 20.74,9.52 v20.63,9.63 | R7.2 22.63,22.64 v21.63,21.63 | v24.1,7.97 25.63,9.5 R9.2 | LED3.C 19.05,76.99 17.68,75.62 v17.64,75.62 | LED1.C 18.68,72 17.64,70.96 v17.64,70.65 | LED2.C 18.72,67.04 17.62,65.94 v17.62,65.61
  Top 0.813: U$3.GND1 J2.25 | U$3.GND3 J1.16 | U$3.GND6 J1.3
  Top 1.016: v45.67,55.84 45.67,56.09 46.64,57.06 50.17,57.06 v50.18,57.07 | SSM3J372R,LF.1 52.98,75.81
  Top 1.27: 52.98,75.81 v52.53,76.26
  Bottom 1.016: v17.62,65.61 17.62,70.63 v17.64,70.65 v17.64,75.62 | 49.13,32.72 49.21,32.8 | 38.34,70.92 38.33,70.93 | 46.7,9.97 47.86,9.97 49.13,11.24 49.24,11.24 50.51,9.97
  Bottom 1.27: 47.94,34.07 49.21,32.8 50.48,34.07 | 55.31,68.39 J1.3 | U$1.GND 20.26,36 18.63,37.63 12.63,37.63 10.78,39.48 RF1.GND 10.78,50.53 20.52,60.27 20.52,62.12 19.68,62.96 | 20.52,61.75 21.69,62.92 | 21.69,62.92 25.9,67.12 25.9,70.9 27.91,72.91 32.02,72.91 J2.25 | 19.68,62.96 17.62,65.02 v17.62,65.61 | 49.13,11.24 49.13,32.72 | J1.3 | 38.34,70.92 40.88,68.38 40.88,53.77 GPS1.GND 40.95,53.12 40.95,45.53 | 57.09,70.17 55.31,68.39 | 55.31,68.39 55.26,68.34 55.3,68.34 56.82,66.82 57.09,67.09 | v52.53,76.26 53.01,75.78 54.01,75.78 57.09,72.71 57.09,70.17 | 57.09,70.17 57.09,68.39 | 57.09,68.39 57.09,67.09 | 57.09,67.09 57.09,59.6 60.12,56.57 CON1.- | 40.95,38.51 40.95,14.19 45.17,9.97 46.7,9.97 50.51,9.97 58.87,9.97 60.86,7.98 COMP1.GND | 50.48,34.07 U$3.GND3 | 47.94,34.07 50.48,34.07 | 57.09,68.39 J1.3 | 19.68,62.96 21.65,62.96 21.69,62.92 | 38.33,70.93 U$3.GND1 | 40.95,38.51 40.95,45.53 | U$4.GND 41.09,45.66 40.95,45.53 | 40.95,38.51 41.28,38.18 41.28,37.41 44.62,34.07 47.94,34.07
  other vias: 18.03,46.63 24.39,45.89 15.03,46.63 16.5,31.98 21.9,31.98 38.53,51.83 44.03,33.93 43.65,13.75 38.43,13.73 38.43,17.23 38.43,21.83 38.43,26.83 38.33,31.53 50.53,51.73 40.78,26.86 40.79,31.53 31.13,43.69 31.11,45.82 31.12,51.22 31.12,48.01 16.41,20.06 6.44,19.91 16.4,11.99 16.45,27.95 26.45,15.24 16.4,15.24 16.42,7.26 6.47,15.03 16.4,23.22 12.1,40.82 14.62,40.82 17.14,40.87 19.74,40.87 22.34,40.84 24.88,40.92 42.77,51.64 42.77,55.73 39,55.74 30.19,68.18 29.87,59.53 30.15,71.46 56.63,43.63 56.63,38.63 56.63,33.63 56.63,28.63 56.63,23.63 56.63,18.63 56.63,48.63 58.81,6.84 50.63,41.63 50.63,31.63 38.63,45.63 31.14,40.58 42.63,60.63 39.11,64.23 39.04,66.99 43.58,72.79 31.46,21.48 31.54,17.43 40.89,76.13 56.88,72.53 20.63,25.69 26.46,20.05 31.05,29.93 31.03,31.94 19.5,31.98 31.03,34.26 22.63,38.19 43.7,17.38 43.74,21.79 46.61,24.71 47.01,21.76 47.22,17.34 47.28,13.79 27.63,45.83 27.61,47.77 27.58,49.62 24.4,49.61 24.39,47.73 66.32,72.05 50.39,75.83 38.22,72.83 49.17,69.66 49.16,66.2 47.63,61.63 47.63,64.63 50.05,61.69 47.63,56.79 21.37,49.55 27.69,31.91 24.69,31.94 27.66,29.88 21.91,29.9 51.01,72.85 48.51,73.81 40.71,21.84 40.77,17.24 40.71,13.67 9.63,13.63 59,72.52 59,67.54 70.86,68.22 68.73,63.73 64.33,59.03 66.36,68.52 11.63,18.63 21.4,51.76 24.42,51.73 27.55,51.71 51.6,76.25 51.56,77.28 52.55,77.28 21.43,46.43 50.07,59.22 47.63,59.22 48.65,43.63 48.65,38.63 48.65,33.63 48.65,28.09 21.63,16.74 58.78,13.22 66.22,77.77 9.79,23.96 41.38,41.65 40.93,35.34
  pour Bottom: -3.97,-0.96 83.22,-0.96 83.22,84.23 -3.97,84.23
  pour Top: -3.97,-0.96 83.22,-0.96 83.22,84.23 -3.97,84.23
GPS_PPS  (via drill 0.35)
  Top 0.305: U$4.PPS 46.5,41.72 v46.7,41.72 | v47.97,46.8 U$3.18-A4/SDA0/PWM18
  Top 0.813: J1.10 U$3.18-A4/SDA0/PWM18
  Bottom 0.305: v46.7,41.72 46.7,45.53 v47.97,46.8
GPS_RX  (1 unrouted)
  Top 0.305: U$4.RX 46.32,44.08 GPS1.RX
  Top 0.508: GPS1.RX 46.32,53.95 48.08,55.7 51.76,55.7
  Top 0.813: U$3.20-A6/TX5/LRCLK1 J1.8
GPX_TX  (1 unrouted)
  Top 0.305: U$4.TX 43.02,43.12 44.67,44.77 44.67,52.52 GPS1.TX
  Top 0.508: GPS1.TX 43.78,56.31 45.98,58.51 51.49,58.51
  Top 0.813: U$3.21-A7/RX5/BCLK1 J1.7
LED1  (via drill 0.35)
  Top 0.508: v29.63,69.63 29.22,69.63 27.11,71.74 R16.1
  Top 0.813: U$3.0-RX1/CS1/CRX2/PWM00 J2.24
  Bottom 0.813: J2.24 31.97,68.39 30.72,69.63 v29.63,69.63
LED2  (via drill 0.35)
  Top 0.508: v30.14,65.89 28.86,65.89 27.63,67.12 R17.1
  Top 0.813: U$3.1-TX1/MISO1/CTX2/PWM01 J2.23
  Bottom 0.813: v30.14,65.89 30.18,65.85 J2.23
N$1
  Top 0.813: J1.5 U$3.23-A9/CRX1/MCLK1/PWM23
N$2
  Top 0.813: U$3.22-A8/CTX1/PWM22 J1.6
N$4  (1 unrouted)
N$5
  Top 0.813: J3.12 J4.12
N$6
  Top 0.813: J2.2 U$3.32-OUT1B
N$7
  Top 0.813: U$3.14-A0/TX3/SPDIF_OUT/PWM14 J1.14
N$8
  Top 0.813: U$3.13-SCK/LED/PWM13 J1.15
N$9
  Top 0.813: U$3.41-A17/MISO1 J1.17
N$10
  Top 0.813: U$3.40-A16/CS1 J1.18
N$11
  Top 0.813: U$3.39-A15/CS/OUT1A J1.19
N$12
  Top 0.813: U$3.38-A14/CS/IN1 J1.20
N$13
  Top 0.813: U$3.37-CS/PWM37 J1.21
N$14
  Top 0.813: U$3.36-CS/PWM36 J1.22
N$15
  Top 0.813: U$3.35-TX8 J1.23
N$16
  Top 0.813: U$3.34-RX8 J1.24
N$17
  Top 0.813: J3.11 J4.11
N$18
  Top 0.813: J3.10 J4.10
N$19
  Top 0.813: U$3.19-A5/SCL0/PWM19 J1.9
N$20
  Top 0.813: U$3.3-LRCLK2/PWM03 J2.21
N$21
  Top 0.813: U$3.4-BCLK2/PWM04 J2.20
N$22
  Top 0.813: U$3.5-IN2/PWM05 J2.19
N$23
  Top 0.813: U$3.11-MOSI/CTX1/PWM11 J2.13
N$24
  Top 0.813: U$3.12-MISO/MQSL/PWM12 J2.12
N$25
  Top 0.813: J3.9 J4.9
N$26
  Top 0.813: U$3.26-A12/MOSI1 J2.8
N$27
  Top 0.813: J3.8 J4.8
N$28
  Top 0.813: U$3.2-OUT2/PWM02 J2.22
N$29
  Top 0.813: J3.7 J4.7
N$30
  Top 0.813: J3.6 J4.6
N$31
  Top 0.813: J3.5 J4.5
N$32
  Top 0.508: R15.2 LED3.A
N$33
  Top 0.508: LED1.A R16.2
N$34
  Top 0.813: J3.4 J4.4
N$35
  Top 0.813: J3.3 J4.3
N$36
  Top 0.813: J3.2 J4.2
N$37
  Top 0.813: J3.1 J4.1
N$38
  Top 0.813: J5.12 J6.12
N$39
  Top 0.813: J5.11 J6.11
N$40
  Top 0.813: J5.10 J6.10
N$41
  Top 0.813: J5.9 J6.9
N$42
  Top 2.54: S6.3 64,70.55 63.37,71.17 F1.2
N$43
  Top 1.27: SSM3J372R,LF.3 55.99,74.9 56.87,74.9
  Top 2.54: F1.1 58.14,76.18 56.87,74.9 56.85,74.88
N$44
  Top 1.016: SSM3J372R,LF.2 52.66,73.91 52.63,73.94
  Top 1.27: PS1.VIN 42.17,75 43.8,76.63 47.63,76.63 50.32,73.94 52.63,73.94
N$45
  Top 0.813: J5.8 J6.8
N$46
  Top 0.813: J5.7 J6.7
N$47
  Top 0.813: J5.6 J6.6
N$48
  Top 0.813: J5.5 J6.5
N$49
  Top 0.813: J5.4 J6.4
N$50
  Top 0.813: J5.3 J6.3
N$51
  Top 0.813: J5.2 J6.2
N$52
  Top 0.813: J5.1 J6.1
N$53
  Top 0.508: R17.2 25.19,67.04 LED2.A
OLED_SCL
  Top 0.305: 33.88,32.83 33.55,33.16
  Top 0.508: U$1.SCL 15.18,34.37 16.39,33.16 33.55,33.16
  Top 0.813: 33.88,32.83 J2.10 U$3.24-A10/TX6/SCL2/PWM24
OLED_SDA
  Top 0.508: U$1.SDA 12.64,33.81 15.58,30.87 32.15,30.87 32.73,30.29 J2.9
  Top 0.813: U$3.25-A11/RX6/SDA2/PWM25 J2.9
RF_AUX
  Top 0.508: RF1.AUX 15.86,45.86 20.63,50.63 28.63,50.63 31.14,53.15 J2.18
  Top 0.813: U$3.6-OUT1D/PWM06 J2.18
RF_MODE0
  Top 0.508: RF1.M0 33.77,42.76 J2.14
  Top 0.813: U$3.10-CS\MQSR/PWM10 J2.14
RF_MODE1
  Top 0.508: RF1.M1 23.48,43.57 24.63,44.72 32.26,44.72 33.06,45.53 J2.15
  Top 0.813: U$3.9-OUT1C/PWM09 36.05,45.53 35.95,45.42 34.86,45.42 34.75,45.53 J2.15
RF_RX
  Top 0.508: RF1.RX 20.94,44.14 23.53,46.73 32.24,46.73 33.57,48.07 J2.16
  Top 0.813: U$3.8-TX2/IN1/PWM08 J2.16
RF_TX
  Top 0.508: RF1.TX 18.4,44.4 22.63,48.63 29.63,48.63 31.6,50.61 J2.17
  Top 0.813: U$3.7-RX2/OUT1A/PWM07 36.05,50.61 35.95,50.72 34.86,50.72 34.75,50.61 J2.17
V_BATT
  Top 2.54: CON1.+ 62.71,61.57 68.69,67.55 S6.2

### Text on the board
tNames: 5V | 470 | ON | 0 | 330 | 1 | 330 | BASE STATION GPS TRACKER | V1.0 MICHAEL VENZ | OLED_LCD | 25 | 24 | 3V3 | - | 10k | 10k | 30 | 29 | 27 | 28 | 10k | 10k | 10k | 31
bNames: E22_900T22DC | - | 5V | VBAT | 2 | + | MPM3610 | - | 21 | 20 | 3V3 | - | - | 5V | 6 | 7 | 8 | 9 | 10 | GY271_COMPASS | BASE STATION GPS TRACKER | V1.0 MICHAEL VENZ